# Altium schematic sheet STM32H743IIT6.SchDoc
size A2
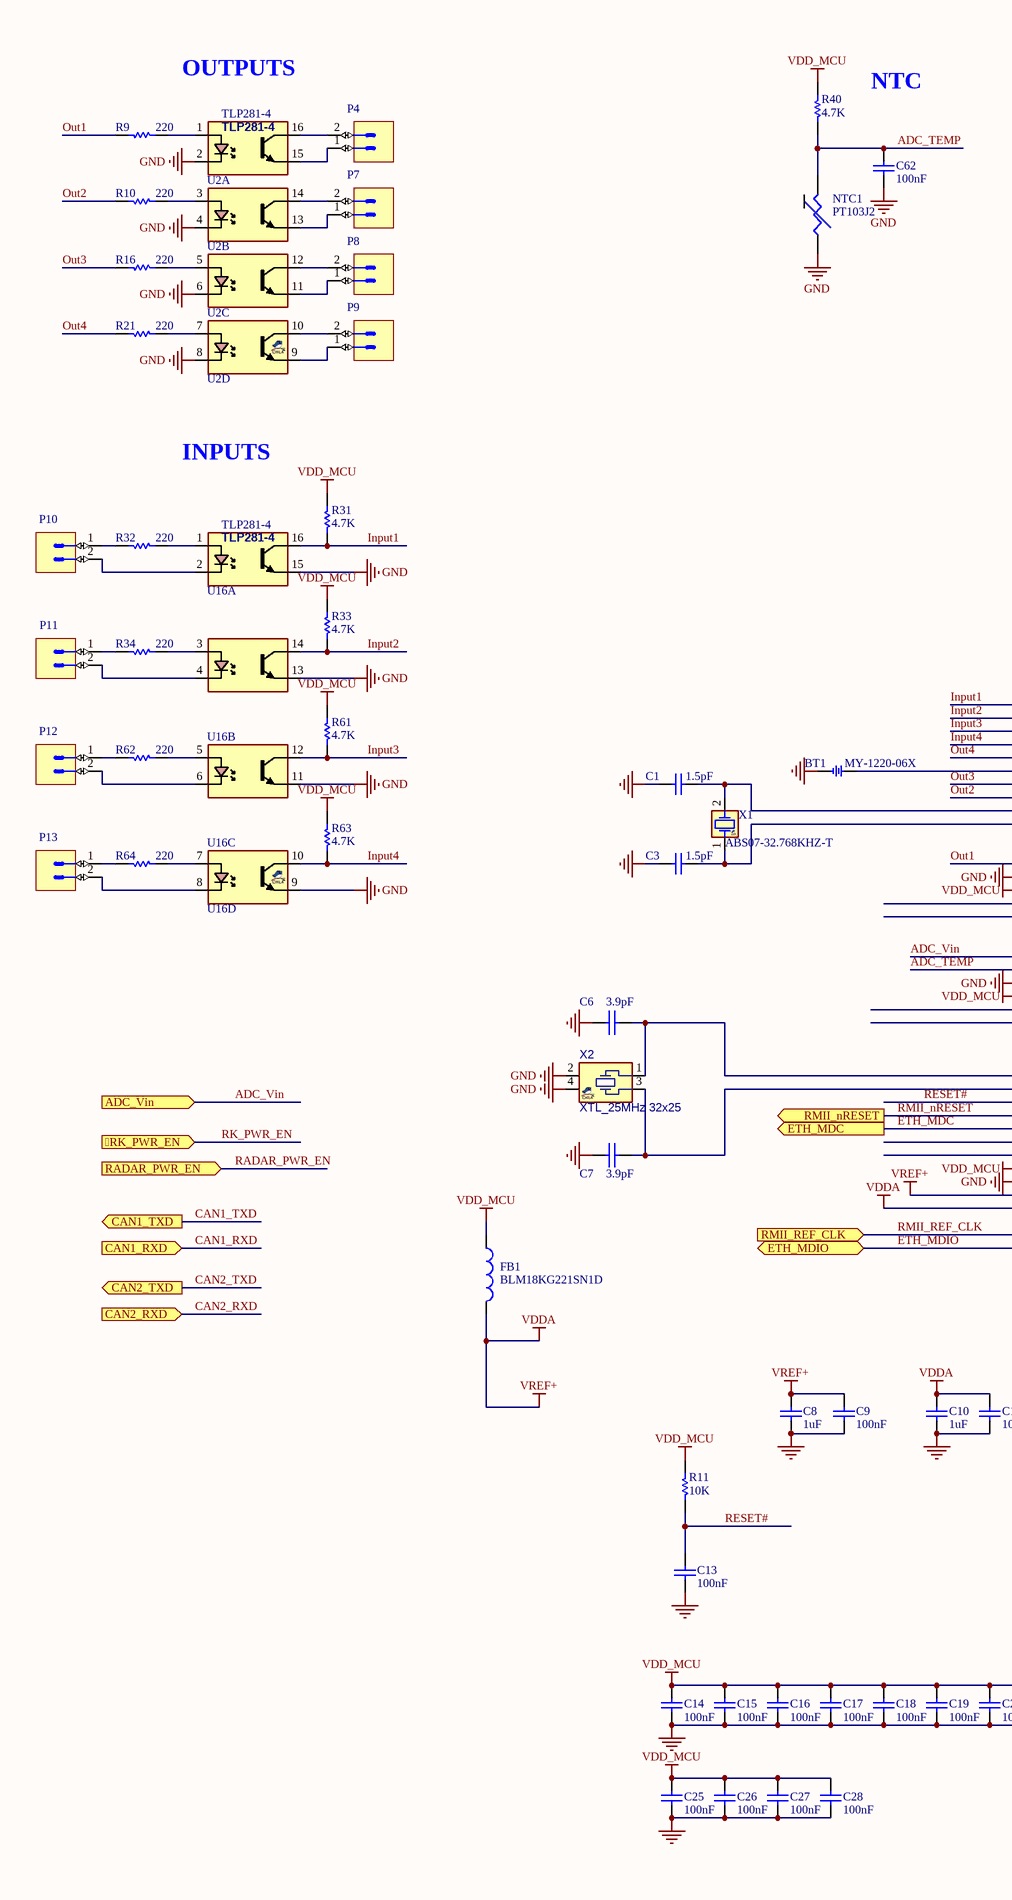
[diagram p0: STM32H743IIT6.SchDoc, left]
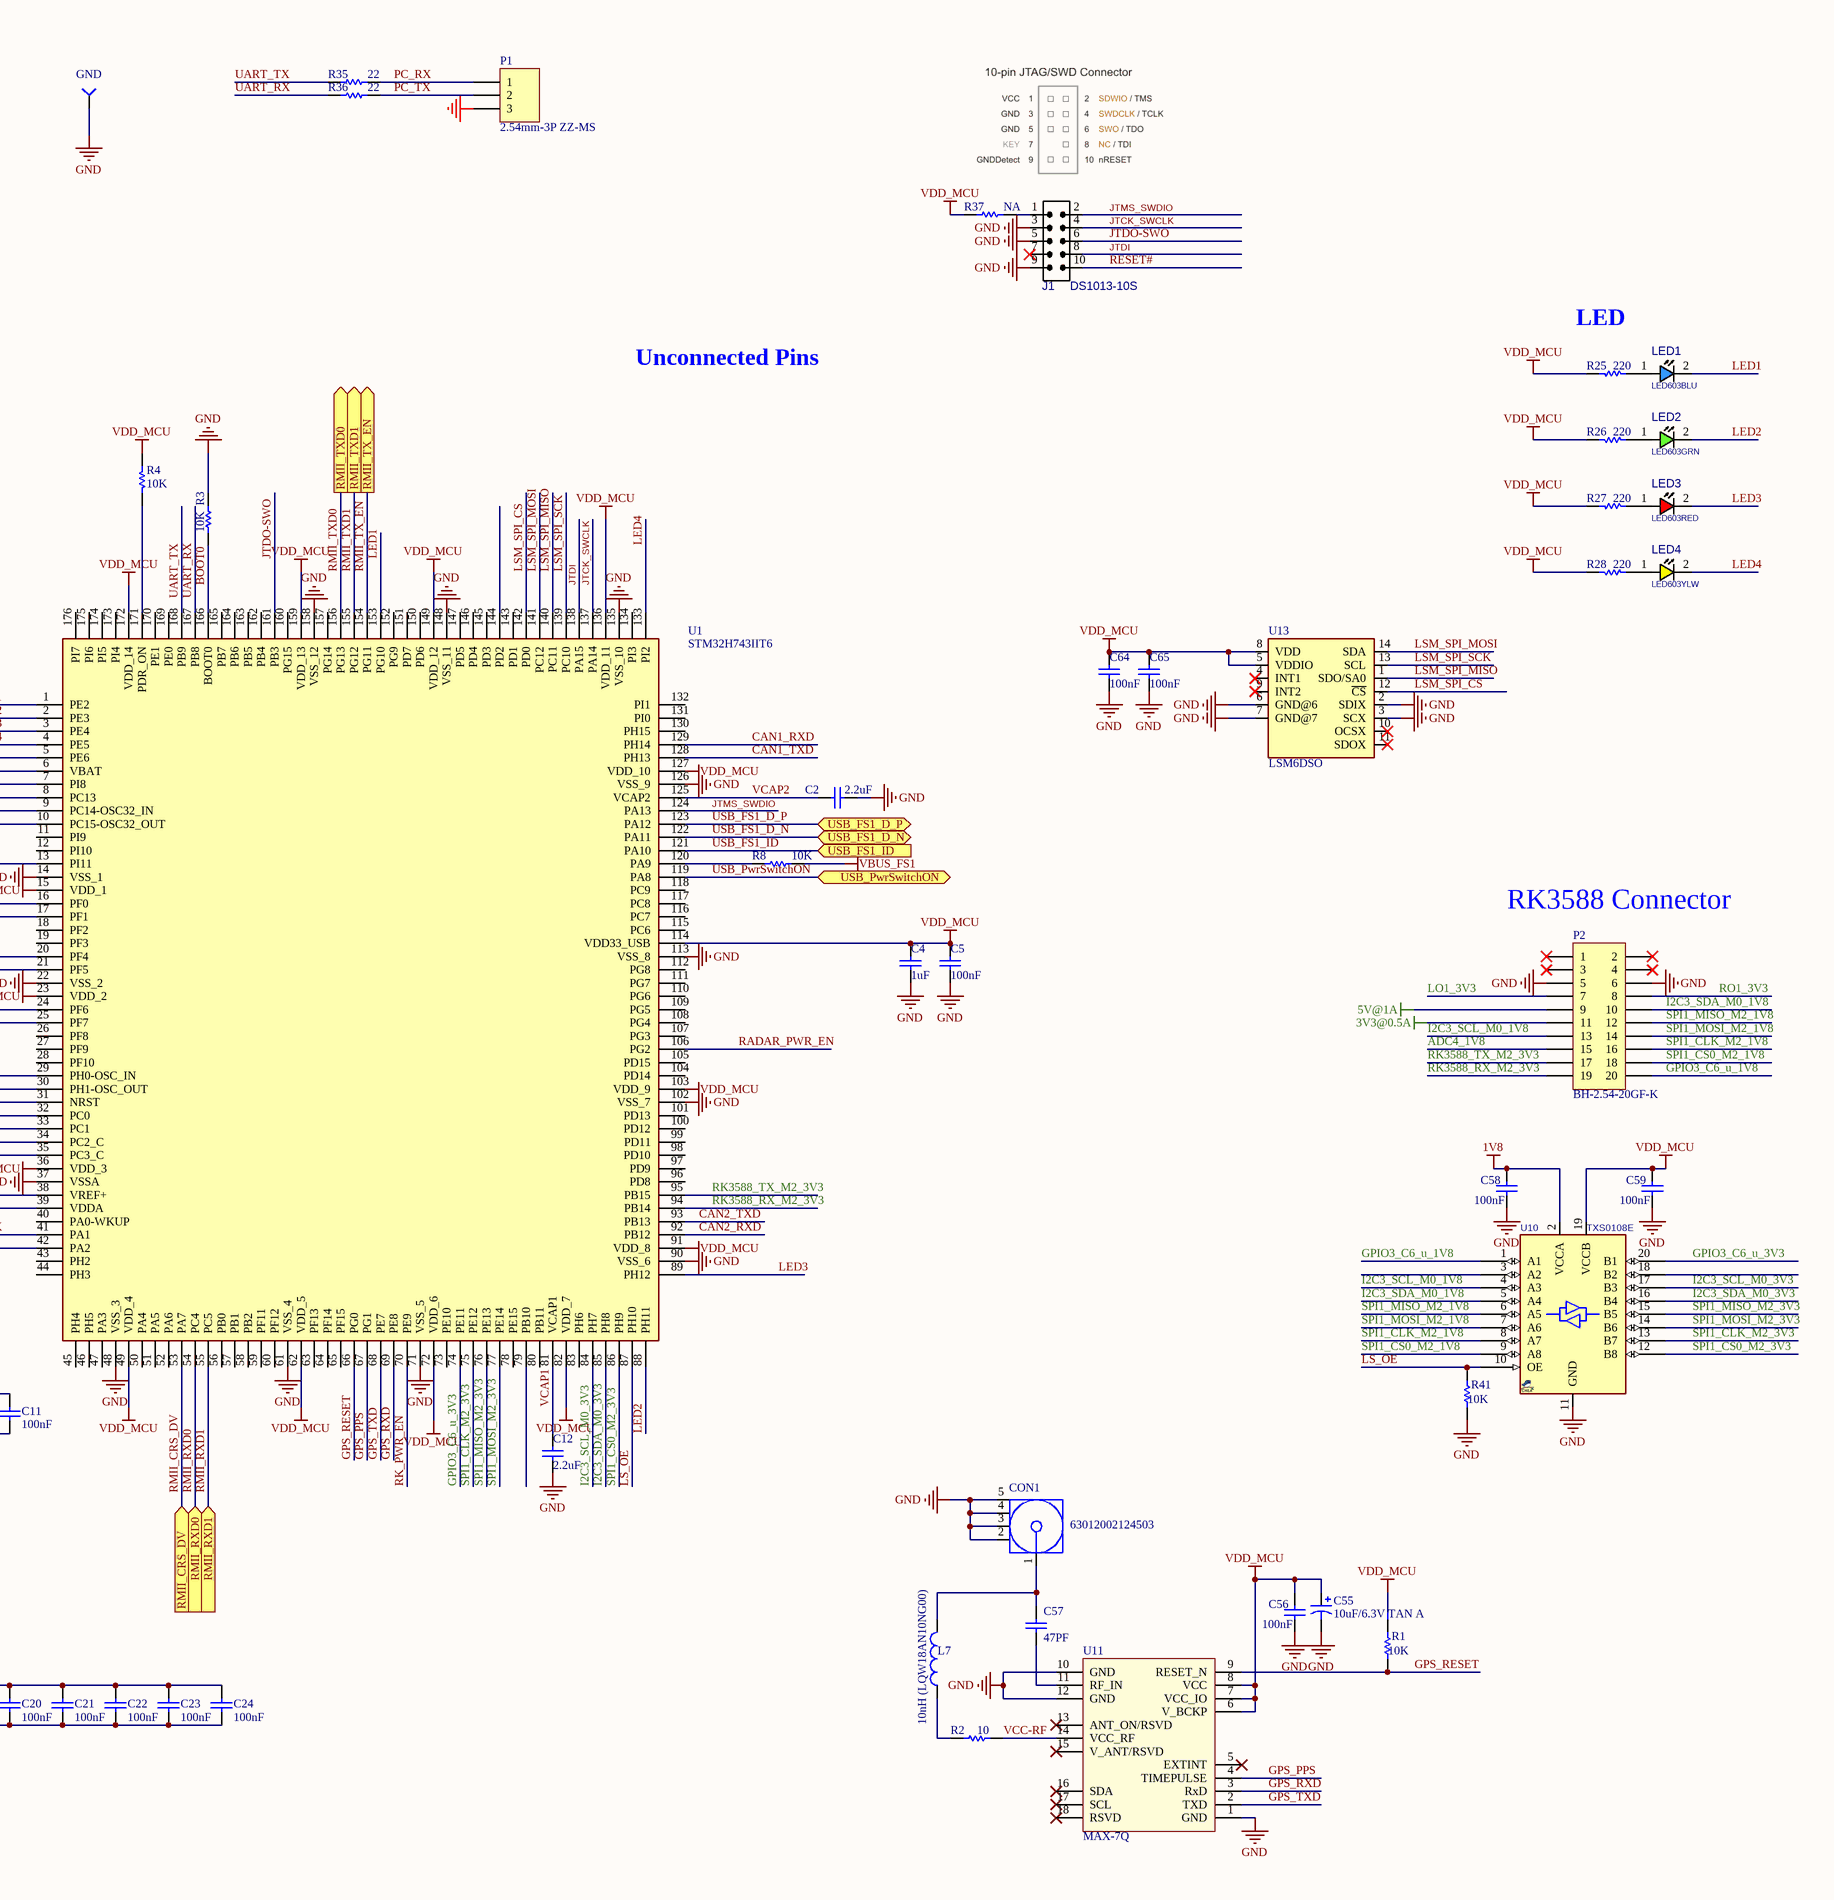
[diagram p1: STM32H743IIT6.SchDoc, right]

## Parts
BT1  MY-1220-06X  [BAT-TH_MY-1220-01]
C1  1.5pF  [C0603]
C2  2.2uF  [C0603]
C3  1.5pF  [C0603]
C4  1uF  [C0603]
C5  100nF  [C0603]
C6  3.9pF  [C0603]
C7  3.9pF  [C0603]
C8  1uF  [C0603]
C9  100nF  [C0603]
C10  1uF  [C0603]
C11  100nF  [C0603]
C12  2.2uF  [C0603]
C13  100nF  [C0603]
C14  100nF  [C0603]
C15  100nF  [C0603]
C16  100nF  [C0603]
C17  100nF  [C0603]
C18  100nF  [C0603]
C19  100nF  [C0603]
C20  100nF  [C0603]
C21  100nF  [C0603]
C22  100nF  [C0603]
C23  100nF  [C0603]
C24  100nF  [C0603]
C25  100nF  [C0603]
C26  100nF  [C0603]
C27  100nF  [C0603]
C28  100nF  [C0603]
C55  10uF/6.3V TAN A  [TANTALUM-A]
C56  100nF  [C0603]
C57  47PF  [C0603]
C58  100nF  [C0603]
C59  100nF  [C0603]
C62  100nF  [C0603]
C64  100nF  [C0603]
C65  100nF  [C0603]
CON1  63012002124503  [SMA]
FB1  BLM18KG221SN1D  [L0603E]
GND  TEST POINT  [TEST_POINT]  (value not drawn)  (no BOM)
J1  DS1013-10S  [IDC_2X5]
L7  10nH (LQW18AN10NG00)  [L0603E]
LED1  LED603BLU  [LED0603BLU]
LED2  LED603GRN  [LED0603GRN]
LED3  LED603RED  [LED0603RED]
LED4  LED603YLW  [LED0603YLW]
NTC1  PT103J2  [HDR1X2]
P1  2.54mm-3P ZZ-MS  [xh-3]
P2  BH-2.54-20GF-K  [HDR2X10]
P4  JST PH 2mm 2P RIGHT  [JST B2B-PH-K]  (value not drawn)
P7  JST PH 2mm 2P RIGHT  [JST B2B-PH-K]  (value not drawn)
P8  JST PH 2mm 2P RIGHT  [JST B2B-PH-K]  (value not drawn)
P9  JST PH 2mm 2P RIGHT  [JST B2B-PH-K]  (value not drawn)
P10  JST PH 2mm 2P RIGHT  [JST B2B-PH-K]  (value not drawn)
P11  JST PH 2mm 2P RIGHT  [JST B2B-PH-K]  (value not drawn)
P12  JST PH 2mm 2P RIGHT  [JST B2B-PH-K]  (value not drawn)
P13  JST PH 2mm 2P RIGHT  [JST B2B-PH-K]  (value not drawn)
R1  10K  [R0603]
R2  10  [R0603]
R3  10K  [R0603]
R4  10K  [R0603]
R8  10K  [R0603]
R9  220  [R0603]
R10  220  [R0603]
R11  10K  [R0603]
R16  220  [R0603]
R21  220  [R0603]
R25  220  [R0603]
R26  220  [R0603]
R27  220  [R0603]
R28  220  [R0603]
R31  4.7K  [R0603]
R32  220  [R0603]
R33  4.7K  [R0603]
R34  220  [R0603]
R35  22  [R0603]
R36  22  [R0603]
R37  NA  [R0603]  (no BOM)
R40  4.7K  [R0603]
R41  10K  [R0603]
R61  4.7K  [R0603]
R62  220  [R0603]
R63  4.7K  [R0603]
R64  220  [R0603]
U1  STM32H743IIT6  [QFP50P2600X2600X160-176N]
U2  TLP281-4  [SO_16]  (parts A,B,C,D of 4)
U10  TXS0108E  [SOG65_20]
U11  MAX-7Q  [MAX]
U13  LSM6DSO  [LGA-14_L3.0-W2.5-P0.50-TL]
U16  TLP281-4  [SO_16]  (parts A,B,C,D of 4)
X1  ABS07-32.768KHZ-T  [XTL_2_3215]
X2  XTL_25MHz 32x25  [XTL_4_3225]

## Ports
RK_PWR_EN (in), ADC_Vin (in), CAN1_RXD (in), CAN1_TXD (out), CAN2_RXD (in), CAN2_TXD (out), ETH_MDC (out), ETH_MDIO (bidir), RADAR_PWR_EN (in), RMII_CRS_DV (in), RMII_nRESET (out), RMII_REF_CLK (in), RMII_RXD0 (in), RMII_RXD1 (in), RMII_TX_EN (out), RMII_TXD0 (out), RMII_TXD1 (out), USB_FS1_D_N (bidir), USB_FS1_D_P (bidir), USB_FS1_ID (in), USB_PwrSwitchON (bidir)

## Nets
1V8: C58.1 U10.2(VCCA)
3V3@0.5A: P2.11
5V@1A: P2.9
GND: BT1.2 C1.2 C2.2 C3.2 C4.1 C5.1 C6.2 C7.2 C8.1 C9.1 C10.1 C11.1 C12.1 C13.1 C14.2 C15.2 C16.2 C17.2 C18.2 C19.2 C20.2 C21.2 C22.2 C23.2 C24.2 C25.2 C26.2 C27.2 C28.2 C55.2 C56.2 C58.2 C59.2 C62.1 C64.1 C65.1 CON1.2(GND) CON1.3(GND) CON1.4(GND) CON1.5(GND) GND.1(TP) J1.3 J1.5 J1.9 NTC1.1 P1.3 P2.5 P2.6 R3.2 R41.1 U1.14(VSS_1) U1.22(VSS_2) U1.37(VSSA) U1.48(VSS_3) U1.61(VSS_4) U1.71(VSS_5) U1.90(VSS_6) U1.102(VSS_7) U1.113(VSS_8) U1.126(VSS_9) U1.135(VSS_10) U1.148(VSS_11) U1.158(VSS_12) U2.2 U2.4 U2.6 U2.8 U10.11(GND) U11.1(GND) U11.10(GND) U11.12(GND) U13.2(SDIX) U13.3(SCX) U13.6(GND@6) U13.7(GND@7) U16.9 U16.11 U16.13 U16.15 X2.2 X2.4
VBUS_FS1: R8.1
VDD_MCU: C4.2 C5.2 C14.1 C15.1 C16.1 C17.1 C18.1 C19.1 C20.1 C21.1 C22.1 C23.1 C24.1 C25.1 C26.1 C27.1 C28.1 C55.1 C56.1 C59.1 C64.2 C65.2 FB1.1 R1.2 R4.1 R11.1 R25.1 R26.1 R27.1 R28.1 R31.2 R33.2 R37.2 R40.1 R61.2 R63.2 U1.15(VDD_1) U1.23(VDD_2) U1.36(VDD_3) U1.49(VDD_4) U1.62(VDD_5) U1.72(VDD_6) U1.82(VDD_7) U1.91(VDD_8) U1.103(VDD_9) U1.114(VDD33_USB) U1.127(VDD_10) U1.136(VDD_11) U1.149(VDD_12) U1.159(VDD_13) U1.172(VDD_14) U10.19(VCCB) U11.6(V_BCKP) U11.7(VCC_IO) U11.8(VCC) U13.5(VDDIO) U13.8(VDD)
VDDA: C8.2 C9.2 C10.2 C11.2 FB1.2 U1.38(VREF+) U1.39(VDDA)  [also labelled VREF+]
ADC4_1V8: P2.15
ADC_TEMP: C62.2 NTC1.2 R40.2 U1.21(PF5)
ADC_Vin: U1.20(PF4) ; port ADC_Vin
BOOT0: R3.1 U1.166(BOOT0)
CAN1_RXD: U1.129(PH14) ; port CAN1_RXD
CAN1_TXD: U1.128(PH13) ; port CAN1_TXD
CAN2_RXD: U1.92(PB12) ; port CAN2_RXD
CAN2_TXD: U1.93(PB13) ; port CAN2_TXD
ETH_MDC: U1.33(PC1) ; port ETH_MDC
ETH_MDIO: U1.42(PA2) ; port ETH_MDIO
GPIO3_C6_u_1V8: P2.20 U10.1(A1)
GPIO3_C6_u_3V3: U1.74(PE11) U10.20(B1)
GPS_PPS: U1.67(PG1) U11.4(TIMEPULSE)
GPS_RESET: R1.1 U1.66(PG0) U11.9(RESET_N)
GPS_RXD: U1.69(PE8) U11.3(RxD)
GPS_TXD: U1.68(PE7) U11.2(TXD)
I2C3_SCL_M0_1V8: P2.13 U10.4(A3)
I2C3_SCL_M0_3V3: U1.84(PH7) U10.17(B3)
I2C3_SDA_M0_1V8: P2.10 U10.5(A4)
I2C3_SDA_M0_3V3: U1.85(PH8) U10.16(B4)
Input1: R31.1 U1.1(PE2) U16.16
Input2: R33.1 U1.2(PE3) U16.14
Input3: R61.1 U1.3(PE4) U16.12
Input4: R63.1 U1.4(PE5) U16.10
JTCK_SWCLK: J1.4 U1.137(PA14)
JTDI: J1.8 U1.138(PA15)
JTDO-SWO: J1.6 U1.161(PB3)
JTMS_SWDIO: J1.2 U1.124(PA13)
LED1: LED1.2(CATHODE) U1.153(PG10)
LED2: LED2.2(CATHODE) U1.88(PH11)
LED3: LED3.2(CATHODE) U1.89(PH12)
LED4: LED4.2(CATHODE) U1.133(PI2)
LO1_3V3: P2.7
LS_OE: R41.2 U1.87(PH10) U10.10(OE)
LSM_SPI_CS: U1.142(PD0) U13.12(~{CS})
LSM_SPI_MISO: U1.140(PC11) U13.1(SDO/SA0)
LSM_SPI_MOSI: U1.141(PC12) U13.14(SDA)
LSM_SPI_SCK: U1.139(PC10) U13.13(SCL)
Out1: R9.1 U1.13(PI11)
Out2: R10.1 U1.8(PC13)
Out3: R16.1 U1.7(PI8)
Out4: R21.1 U1.5(PE6)
PC_RX: P1.1 R35.1
PC_TX: P1.2 R36.1
RADAR_PWR_EN: U1.106(PG2) ; port RADAR_PWR_EN
RESET#: C13.2 J1.10 R11.2 U1.31(NRST)
RK3588_RX_M2_3V3: P2.19 U1.94(PB14)
RK3588_TX_M2_3V3: P2.17 U1.95(PB15)
RK_PWR_EN: U1.70(PE9) ; port RK_PWR_EN
RMII_CRS_DV: U1.53(PA7) ; port RMII_CRS_DV
RMII_nRESET: U1.32(PC0) ; port RMII_nRESET
RMII_REF_CLK: U1.41(PA1) ; port RMII_REF_CLK
RMII_RXD0: U1.54(PC4) ; port RMII_RXD0
RMII_RXD1: U1.55(PC5) ; port RMII_RXD1
RMII_TX_EN: U1.154(PG11) ; port RMII_TX_EN
RMII_TXD0: U1.156(PG13) ; port RMII_TXD0
RMII_TXD1: U1.155(PG12) ; port RMII_TXD1
RO1_3V3: P2.8
SPI1_CLK_M2_1V8: P2.16 U10.8(A7)
SPI1_CLK_M2_3V3: U1.75(PE12) U10.13(B7)
SPI1_CS0_M2_1V8: P2.18 U10.9(A8)
SPI1_CS0_M2_3V3: U1.86(PH9) U10.12(B8)
SPI1_MISO_M2_1V8: P2.12 U10.6(A5)
SPI1_MISO_M2_3V3: U1.76(PE13) U10.15(B5)
SPI1_MOSI_M2_1V8: P2.14 U10.7(A6)
SPI1_MOSI_M2_3V3: U1.77(PE14) U10.14(B6)
UART_RX: R36.2 U1.167(PB8)
UART_TX: R35.2 U1.168(PB9)
USB_FS1_D_N: U1.122(PA11) ; port USB_FS1_D_N
USB_FS1_D_P: U1.123(PA12) ; port USB_FS1_D_P
USB_FS1_ID: U1.121(PA10) ; port USB_FS1_ID
USB_PwrSwitchON: U1.119(PA8) ; port USB_PwrSwitchON
VCAP1: C12.2 U1.81(VCAP1)
VCAP2: C2.1 U1.125(VCAP2)
VCC-RF: R2.1 U11.14(VCC_RF)
NetBT1_1: BT1.1 U1.6(VBAT)
NetC1_1: C1.1 U1.9(PC14-OSC32_IN) X1.2(OSC2)
NetC3_1: C3.1 U1.10(PC15-OSC32_OUT) X1.1(OSC1)
NetC6_1: C6.1 U1.29(PH0-OSC_IN) X2.1
NetC7_1: C7.1 U1.30(PH1-OSC_OUT) X2.3
NetC57_1: C57.1 CON1.1(Signal) L7.2
NetC57_2: C57.2 U11.11(RF_IN)
NetJ1_1: J1.1 R37.1
NetL7_1: L7.1 R2.2
NetLED1_1: LED1.1(ANODE) R25.2
NetLED2_1: LED2.1(ANODE) R26.2
NetLED3_1: LED3.1(ANODE) R27.2
NetLED4_1: LED4.1(ANODE) R28.2
NetP4_1: P4.1 U2.15
NetP4_2: P4.2 U2.16
NetP7_1: P7.1 U2.13
NetP7_2: P7.2 U2.14
NetP8_1: P8.1 U2.11
NetP8_2: P8.2 U2.12
NetP9_1: P9.1 U2.9
NetP9_2: P9.2 U2.10
NetP10_1: P10.1 R32.1
NetP10_2: P10.2 U16.2
NetP11_1: P11.1 R34.1
NetP11_2: P11.2 U16.4
NetP12_1: P12.1 R62.1
NetP12_2: P12.2 U16.6
NetP13_1: P13.1 R64.1
NetP13_2: P13.2 U16.8
NetR4_2: R4.2 U1.171(PDR_ON)
NetR8_2: R8.2 U1.120(PA9)
NetR9_2: R9.2 U2.1
NetR10_2: R10.2 U2.3
NetR16_2: R16.2 U2.5
NetR21_2: R21.2 U2.7
NetR32_2: R32.2 U16.1
NetR34_2: R34.2 U16.3
NetR62_2: R62.2 U16.5
NetR64_2: R64.2 U16.7

Not connected (* = marked no-connect by the designer): J1 7*; P2 1* 2* 3* 4*; U1 11(PI9) 12(PI10) 16(PF0) 17(PF1) 18(PF2) 19(PF3) 24(PF6) 25(PF7) 26(PF8) 27(PF9) 28(PF10) 34(PC2_C) 35(PC3_C) 40(PA0-WKUP) 43(PH2) 44(PH3) 45(PH4) 46(PH5) 47(PA3) 50(PA4) 51(PA5) 52(PA6) 56(PB0) 57(PB1) 58(PB2) 59(PF11) 60(PF12) 63(PF13) 64(PF14) 65(PF15) 73(PE10) 78(PE15) 79(PB10) 80(PB11) 83(PH6) 96(PD8) 97(PD9) 98(PD10) 99(PD11) 100(PD12) 101(PD13) 104(PD14) 105(PD15) 107(PG3) 108(PG4) 109(PG5) 110(PG6) 111(PG7) 112(PG8) 115(PC6) 116(PC7) 117(PC8) 118(PC9) 130(PH15) 131(PI0) 132(PI1) 134(PI3) 143(PD1) 144(PD2) 145(PD3) 146(PD4) 147(PD5) 150(PD6) 151(PD7) 152(PG9) 157(PG14) 160(PG15) 162(PB4) 163(PB5) 164(PB6) 165(PB7) 169(PE0) 170(PE1) 173(PI4) 174(PI5) 175(PI6) 176(PI7); U10 3(A2) 18(B2); U11 5(EXTINT)* 13(ANT_ON/RSVD)* 15(V_ANT/RSVD)* 16(SDA)* 17(SCL)* 18(RSVD)*; U13 4(INT1)* 9(INT2)* 10(OCSX)* 11(SDOX)*

## Notes on the sheet
- OUTPUTS
- NTC
- Unconnected Pins
- LED
- INPUTS
- (near P2) RK3588 Connector

## Library data of the parts
BT1 = BATH_CR1220: BATTERY HOLDER, CR1220; VALUE: BAT3volt; MANF_P#: -; .: http://www.chila.ir
C1 C3 = Capacitor_ST: Value: 100nF; Revision: July-2002: Re-released for DXP Platform.
C2 C4 C5 C8-C12 C64 C65 = Cap: Value: 10nF; Published: 8-Jun-2000; Revision: July-2002: Re-released for DXP Platform.; Publisher: Altium Limited
C6 C7 C14-C28 = CAP
  C14-C28: Published: 8-Jun-2000; Revision: July-2002: Re-released for DXP Platform.; Publisher: Altium Limited; Value: 100nF
C13 C62 = CAP: Value: 100pF; Published: 8-Jun-2000; Revision: July-2002: Re-released for DXP Platform.; Publisher: Altium Limited
C55 = CAP POL1: SMD Capacitor Tantalum 1UF 10V 10% 1206; Manufacturer: Vishay or Panasonic; Foot print: 1206 (3216 Metric); Published: 8-Jun-2000; LatestRevisionDate: 17-Jul-2002; LatestRevisionNote: Re-released for DXP Platform.; PackageReference: RB7.6-15; Publisher: Altium Limited; Value: 10uF/6.3V TAN A
C56 C58 C59 = Cap: Ceramic Capacitor; Manufacturer: Vishay or Panasonic; Foot print: 0805 (2012 Metric); Published: 8-Jun-2000; LatestRevisionDate: 17-Jul-2002; LatestRevisionNote: Re-released for DXP Platform.; PackageReference: RAD-0.3; Publisher: Altium Limited; Value: 100nF
C57 = Cap: Chip Monolithic Ceramic Capacitor; SMD; Manufacturer: Murata Electronics North America; Manufacturer Part Number: GRM188R71C104KA01D; Current Footprint: 0603 (1608 Metric); Board Qty: 100; PCB Name: Main_PCB; Packing List: CL10B104KB8NNNC; ITEM/NO: 40; ComponentLink1Description: Datasheet; HelpURL: D:\HNA\Datasheet Documents\c02e.pdf; ComponentLink1URL: D:\HNA\Datasheet Documents\c02e.pdf; Mounting Type: Surface Mount; Supplier: NULL; Part Number: 47PF; Supplier Part Number: NULL; Pricing: NULL; Package / Case: 0603 (1608 Metric); Size / Dimension: NULL; Description1: Chip Monolithic Ceramic Capacitor; SMD
CON1 = 19-46-2-TGG: SMA Connector, PCB THT Jack, Straight; Manufacturer: Amphenol Connex; PartNumber: 132134; Foot print: Through Hole; Published: 12-Dec-2006; DatasheetVersion: rev.A-0, Jul-2002; PackageVersion: rev.A-0, Jul-2002; PackageReference: 19-46-2; Publisher: Altium Limited; PackageDescription: SMA Straight PCB Surface Mount Jack Receptacle; ComponentLink1Description: Manufacturer Link; ComponentLink1URL: http://www.chinnan.com.tw/
FB1 = Inductor: Ferrite Bead; Value: 100uH; Published: 8-Jun-2000; Revision: July-2002: Re-released for DXP Platform.; Publisher: Altium Limited
GND = TEST POINT: Board Qty: 100; PCB Name: Main_PCB
J1 = IDC_2X5: BOX HEADER 2*5 STRAIGHT; VALUE: IDC_2X5
L7 = Inductor: FIXED IND 10NH 300MA 0.10 OHM; Manufacturer: Murata Electronics North America; Manufacturer Part Number: 10nH/1%; Current Footprint: 0603 (1608 Metric); Board Qty: 100; PCB Name: Main_PCB; ITEM/NO: 16; Package / Case: 0603 (1608 Metric); Part Number: 10nH (LQW18AN10NG00); Pricing: 1=0.18, 10=0.167, 25=0.1504, 50=0.1302, 100=0.1169, 250=0.10856, 500=0.1002, 750=0.09519, 1000=0.08684 (USD); Size / Dimension: null; Supplier: null; Supplier Part Number: null
LED1 = LED_SMD_0603_BLU: LED, SMD, 0603, BLUE; PARAM: 30mA, 470nm, 120° Angle; DESC: DESCRIPTION; MANF_P#: MANF_PART#; PARAM2: 2.2~3V; MANF: MANF; ASSEMBLY: ASSEMBLY; PRICE: PRICE; VALUE: LED603BLU
LED2 = LED_SMD_0603_GRN: LED, SMD, 0603, GREEN; PARAM: 20mA; MANF: Kingbright; DESC: DESCRIPTION; MANF_P#: APT1608SGC; PARAM2: 2.2V; ASSEMBLY: ASSEMBLY; PRICE: 1: 0.14$, 100: 6.8$; VALUE: LED603GRN
LED3 = LED_SMD_0603_RED: LED, SMD, 0603, RED; PARAM: 30mA, 640nm; DESC: DESCRIPTION; MANF_P#: MANF_PART#; PARAM2: 1.8~2.5V; MANF: MANF; ASSEMBLY: ASSEMBLY; PRICE: PRICE; VALUE: LED603RED
LED4 = LED_SMD_0603_YLW: LED, SMD, 0603, YELLOW; DESC: DESCRIPTION; MANF_P#: MANF_PART#; PARAM2: 2.2V; MANF: MANF; ASSEMBLY: ASSEMBLY; PRICE: PRICE; VALUE: LED603YLW
NTC1 = NTC power: THERMISTOR 10K OHM +/-0.20 C; Device Code: 143161
P1 = Header 3: 1x3P XH 2.54mm Male Straight Wire To Board Connector; LatestRevisionDate: 17-Jul-2002; LatestRevisionNote: Re-released for DXP Platform.; Publisher: Altium Limited
P2 = Header 10X2: BOX HEADER 2*10 STRAIGHT; LatestRevisionDate: 17-Jul-2002; LatestRevisionNote: Re-released for DXP Platform.; Publisher: Altium Limited
P4 P7-P13 = PHOENIX_1803426: JST PH 2P RIGHT; Part Description: 8A 160 V, Pitch: 3.81mm, 2 Positions Header; Manufacturer: PHOENIX CONTACT; Manufacturer Part Number: 1803426 (MCV 1,5/2-G-3,81); PressFit: No; Part Number: PHOENIX_1803426; Component Kind: Standard; Component Type: Standard; Footprint: PHOENIX_1803426; Pin Count: 2; Mounted: Yes; Socket: No; SMD: No; Sense: No; Status: None; ComponentHeight: 9.2mm; HelpURL: \\cern.ch\dfs\Applications\Altium\Datasheets\PHOENIX_1803426.pdf; Author: CERN DEM JLC; CreateDate: 5/4/2010; LatestRevisionDate: 5/4/2010
R1 R41 = Res1: Resistor: thick film; SMD; Manufacturer: Yageo; Manufacturer Part Number: null; Current Footprint: 0603 (1608 Metric); Board Qty: 100; PCB Name: Main_PCB; Packing List: 0603F1002T5E; ITEM/NO: 20; ComponentLink1Description: Datasheet; HelpURL: D:\HNA\Datasheet Documents\PYu-RC_Group_51_RoHS_L_0.pdf; ComponentLink1URL: D:\HNA\Datasheet Documents\PYu-RC_Group_51_RoHS_L_0.pdf; Mounting Type: Surface Mount; Supplier: NULL; Part Number: 10K; Supplier Part Number: NULL; Pricing: NULL; Description1: Resistor: thick film; SMD; Package / Case: 0603 (1608 Metric); Size / Dimension: NULL
R2 = Res1: Resistor: thick film; SMD; Manufacturer: Yageo; Part Number: 10R; Manufacturer Part Number: null; Current Footprint: 0603 (1608 Metric); Board Qty: 100; PCB Name: Main_PCB; Packing List: 0603F1002T5E; ITEM/NO: 131; ComponentLink1Description: Datasheet; HelpURL: D:\HNA\Datasheet Documents\PYu-RC_Group_51_RoHS_L_0.pdf; ComponentLink1URL: D:\HNA\Datasheet Documents\PYu-RC_Group_51_RoHS_L_0.pdf; Mounting Type: Surface Mount; Supplier: null; Supplier Part Number: null; Pricing: 1=0.1, 10=0.029, 50=0.0162, 100=0.0123, 250=0.00912, 500=0.00672, 1000=0.00448, 2500=0.00378 (USD); Description1: Resistor: thick film; SMD; Package / Case: 0603 (1608 Metric); Size / Dimension: null
R3 R35 R36 = res1: Value: 1K; Published: 8-Jun-2000; Revision: July-2002: Re-released for DXP Platform.; Publisher: Altium Limited
R4 R8-R11 R16 R21 R25-R28 R31-R34 R37 R40 R61-R64 = Res1: Value: 1K; Published: 8-Jun-2000; Revision: July-2002: Re-released for DXP Platform.; Publisher: Altium Limited
U1 = STM32H743IIT6: Integrated Circuit; Manufacturer_Name: STMicroelectronics; Datasheet Link: https://componentsearchengine.com/Datasheets/1/STM32H743IIT6.pdf; Height: 1.6mm; Manufacturer_Part_Number: STM32H743IIT6; Mouser Part Number: 511-STM32H743IIT6; Mouser Price/Stock: https://www.mouser.co.uk/ProductDetail/STMicroelectronics/STM32H743IIT6?qs=FNcb6ahWXRzE163cq8Rfjg%3D%3D; Arrow Part Number: STM32H743IIT6; Arrow Price/Stock: https://www.arrow.com/en/products/stm32h743iit6/stmicroelectronics?region=nac
U2 U16 = OPTC_TR16P_TLP281-4_SMD: OPTOCOUPLER, TRANSISTOR, QUAD; MANF_P#: TLP281-4A; PRICE: 4000t@PAYA; VALUE: TLP281-4; PACKAGE: DIP-16SMD
U10 = TXS0108_SSOP20: Level Translator, Octal; MANF: Texas Instruments; MANF_P#: TXS0108EPWR; VALUE: TXS0108E
U11 = MAX: GPS chip module MAX-7Q; Manufacturer-1: ShenZhen Tifull Technology Ltd.; Manufacturer Part Number-1: TF1097U7M3; Part Number: EPP0910; Manufacturer: NULL; Current Footprint: SMD; Board Qty: 100; PCB Name: Main_PCB; ITEM/NO: 117; Package / Case: SMD; Part Number-1: MAX-7Q; Pricing: 1=12.00000, 100=12.00000 (USD); Size / Dimension: NULL; Supplier: Octopart; Supplier Part Number: Seeed Studio - 317050009; HelpURL: D:\HNA\Datasheet Documents\u-blox-MAX-7_DataSheet_(GPS.G7-HW-12012)_2.pdf; Part Number-2: TF1097U7M3; Manufacturer Part Number: NULL
U13 = LSM6DSO: SPARKFUN 6 DEGREES OF FREEDOM BR; MF: STMicroelectronics; SnapEDA_Link: https://www.snapeda.com/parts/LSM6DSO/STMicroelectronics/view-part/?ref=snap; Purchase-URL: https://pricing.snapeda.com/search/part/LSM6DSO/?ref=eda; Price: None; Availability: In Stock; Package: None; Check_prices: https://www.snapeda.com/parts/LSM6DSO/STMicroelectronics/view-part/?ref=eda; Value: *; MP: LSM6DSO
X1 = XTL_2_32.768_3215A: Crystal, 32.768KHz, 3pF, 20PPM; MANF: ABRACON; MANF_P#: ABS07W-32.768kHz-D-2-T; PARAM: -40~85oC; VALUE: XTL_32.768KHz; PARAM2: 3pF, 20PPM; PRICE: 1$
X2 = XTL_4_25MHz_3225: CRYSTAL 25.00 MHZ 18pF, 10PPM; MANF: EPSON; DESC: DESCRIPTION; DIST#: MOUSER; PARAM2: PARAM; MANF_P#: TSX-3225 25.0000MF10P-C3; ASSEMBLY: ASSEMBLY; PARAM: 10PPM; PRICE: 0.5$; VALUE: XTL_25MHz 32x25